# Altium project MyCTRL_V2_Base.PrjPcb
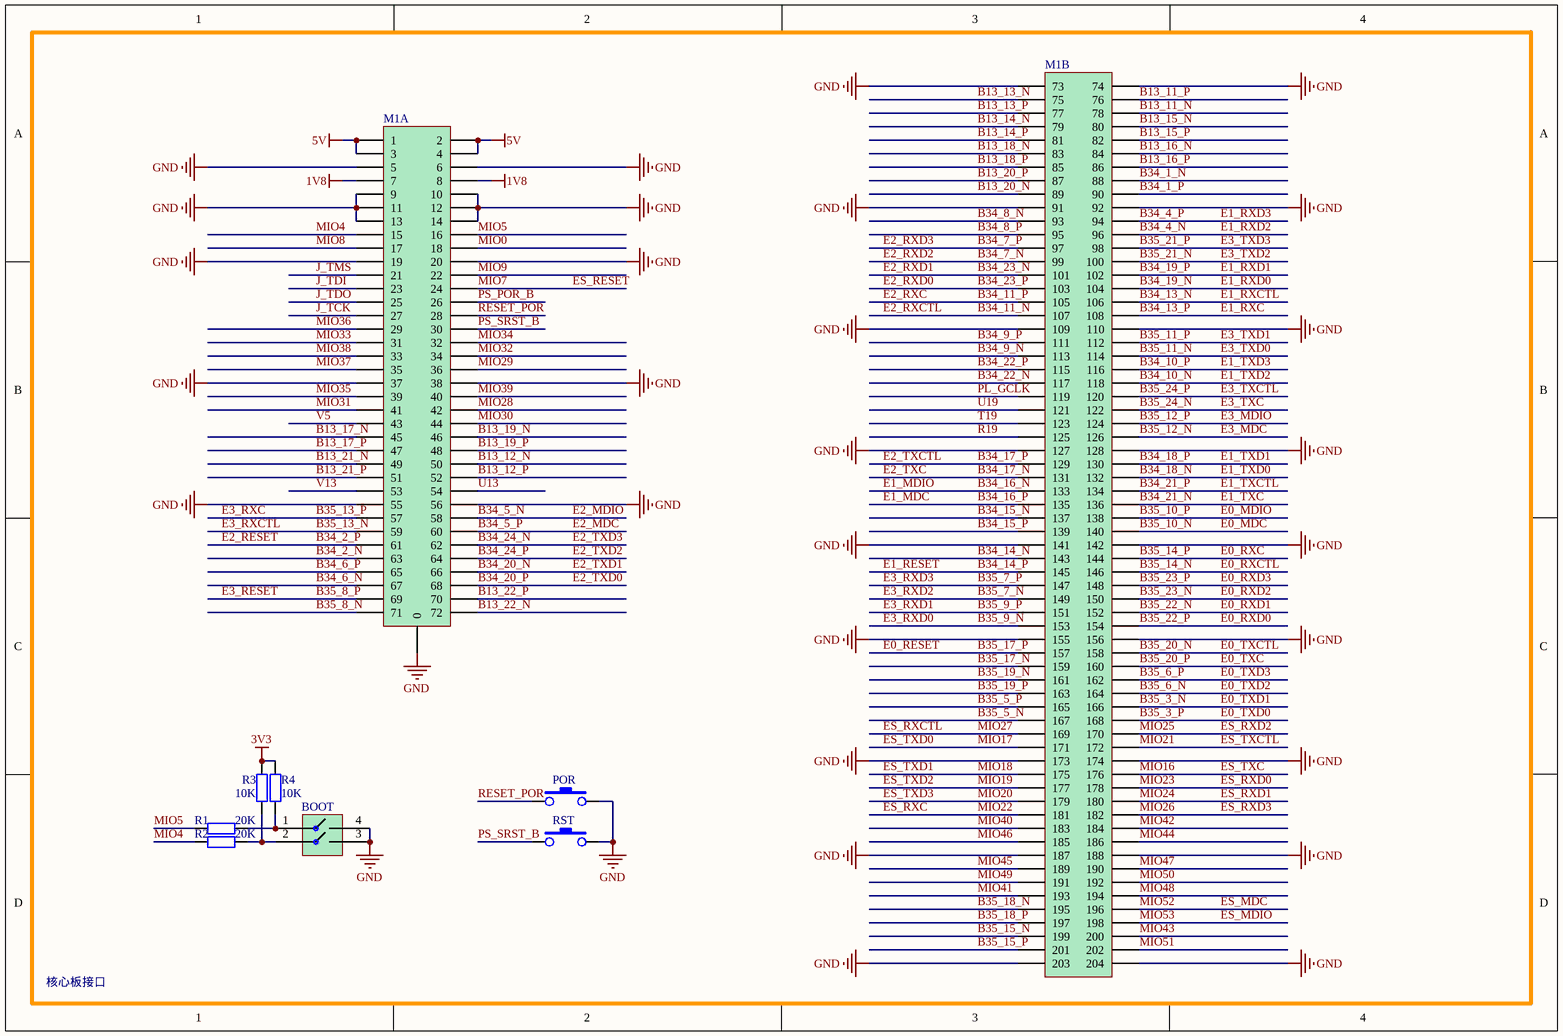
[diagram p0: MyCTRL_V2_Base_1.SchDoc]
6 sheets, 67 parts. Net scope: global (net labels, ports and power ports of the same name join across sheets).
Sheets:
  MyCTRL_V2_Base_1.SchDoc
  MyCTRL_V2_Base_2.SchDoc
  MyCTRL_V2_Base_3.SchDoc
  MyCTRL_V2_Base_4.SchDoc
  MyCTRL_V2_Base_5.SchDoc
  MyCTRL_V2_Base_6.SchDoc

## Sheet MyCTRL_V2_Base_1.SchDoc
size A4; SheetNumber: 1; SheetTotal: 6

### Parts
BOOT  DIP_SWITCH_2.54_2_SMD_S  [DIP_SWITCH_2.54_2_SMD_S]  (value not drawn)
M1  DDR3_204P_H8  [DDR3_204P_H8]  (value not drawn)  (parts A,B of 2)
POR  KEY  [KEY_DIP_6_L]  (value not drawn)
R1  20K  [R_0402]
R2  20K  [R_0402]
R3  10K  [R_0402]
R4  10K  [R_0402]
RST  KEY  [KEY_DIP_6_L]  (value not drawn)

### Nets
1V8: M1.7 M1.8
3V3: R3.2 R4.2
5V: M1.1 M1.2 M1.3 M1.4
GND: BOOT.3 BOOT.4 M1.0 M1.5 M1.6 M1.9 M1.10 M1.11 M1.12 M1.13 M1.14 M1.19 M1.20 M1.37 M1.38 M1.55 M1.56 M1.73 M1.74 M1.91 M1.92 M1.109 M1.110 M1.127 M1.128 M1.141 M1.142 M1.155 M1.156 M1.173 M1.174 M1.187 M1.188 M1.203 M1.204 POR.1 RST.1
B13_11_N: M1.78
B13_11_P: M1.76
B13_12_N: M1.50
B13_12_P: M1.52
B13_13_N: M1.75
B13_13_P: M1.77
B13_14_N: M1.79
B13_14_P: M1.81
B13_15_N: M1.80
B13_15_P: M1.82
B13_16_N: M1.84
B13_16_P: M1.86
B13_17_N: M1.45
B13_17_P: M1.47
B13_18_N: M1.83
B13_18_P: M1.85
B13_19_N: M1.46
B13_19_P: M1.48
B13_20_N: M1.89
B13_20_P: M1.87
B13_21_N: M1.49
B13_21_P: M1.51
B13_22_N: M1.72
B13_22_P: M1.70
B34_1_N: M1.88
B34_1_P: M1.90
B34_2_N: M1.63
B34_2_P: M1.61  [also labelled E2_RESET]
B34_4_N: M1.96  [also labelled E1_RXD2]
B34_4_P: M1.94  [also labelled E1_RXD3]
B34_5_N: M1.58  [also labelled E2_MDIO]
B34_5_P: M1.60  [also labelled E2_MDC]
B34_6_N: M1.67
B34_6_P: M1.65
B34_7_N: M1.99  [also labelled E2_RXD2]
B34_7_P: M1.97  [also labelled E2_RXD3]
B34_8_N: M1.93
B34_8_P: M1.95
B34_9_N: M1.113
B34_9_P: M1.111
B34_10_N: M1.118  [also labelled E1_TXD2]
B34_10_P: M1.116  [also labelled E1_TXD3]
B34_11_N: M1.107  [also labelled E2_RXCTL]
B34_11_P: M1.105  [also labelled E2_RXC]
B34_13_N: M1.106  [also labelled E1_RXCTL]
B34_13_P: M1.108  [also labelled E1_RXC]
B34_14_N: M1.143
B34_14_P: M1.145  [also labelled E1_RESET]
B34_15_N: M1.137
B34_15_P: M1.139
B34_16_N: M1.133  [also labelled E1_MDIO]
B34_16_P: M1.135  [also labelled E1_MDC]
B34_17_N: M1.131  [also labelled E2_TXC]
B34_17_P: M1.129  [also labelled E2_TXCTL]
B34_18_N: M1.132  [also labelled E1_TXD0]
B34_18_P: M1.130  [also labelled E1_TXD1]
B34_19_N: M1.104  [also labelled E1_RXD0]
B34_19_P: M1.102  [also labelled E1_RXD1]
B34_20_N: M1.66  [also labelled E2_TXD1]
B34_20_P: M1.68  [also labelled E2_TXD0]
B34_21_N: M1.136  [also labelled E1_TXC]
B34_21_P: M1.134  [also labelled E1_TXCTL]
B34_22_N: M1.117
B34_22_P: M1.115
B34_23_N: M1.101  [also labelled E2_RXD1]
B34_23_P: M1.103  [also labelled E2_RXD0]
B34_24_N: M1.62  [also labelled E2_TXD3]
B34_24_P: M1.64  [also labelled E2_TXD2]
B35_3_N: M1.166  [also labelled E0_TXD1]
B35_3_P: M1.168  [also labelled E0_TXD0]
B35_5_N: M1.167
B35_5_P: M1.165
B35_6_N: M1.164  [also labelled E0_TXD2]
B35_6_P: M1.162  [also labelled E0_TXD3]
B35_7_N: M1.149  [also labelled E3_RXD2]
B35_7_P: M1.147  [also labelled E3_RXD3]
B35_8_N: M1.71
B35_8_P: M1.69  [also labelled E3_RESET]
B35_9_N: M1.153  [also labelled E3_RXD0]
B35_9_P: M1.151  [also labelled E3_RXD1]
B35_10_N: M1.140  [also labelled E0_MDC]
B35_10_P: M1.138  [also labelled E0_MDIO]
B35_11_N: M1.114  [also labelled E3_TXD0]
B35_11_P: M1.112  [also labelled E3_TXD1]
B35_12_N: M1.126  [also labelled E3_MDC]
B35_12_P: M1.124  [also labelled E3_MDIO]
B35_13_N: M1.59  [also labelled E3_RXCTL]
B35_13_P: M1.57  [also labelled E3_RXC]
B35_14_N: M1.146  [also labelled E0_RXCTL]
B35_14_P: M1.144  [also labelled E0_RXC]
B35_15_N: M1.199
B35_15_P: M1.201
B35_17_N: M1.159
B35_17_P: M1.157  [also labelled E0_RESET]
B35_18_N: M1.195
B35_18_P: M1.197
B35_19_N: M1.161
B35_19_P: M1.163
B35_20_N: M1.158  [also labelled E0_TXCTL]
B35_20_P: M1.160  [also labelled E0_TXC]
B35_21_N: M1.100  [also labelled E3_TXD2]
B35_21_P: M1.98  [also labelled E3_TXD3]
B35_22_N: M1.152  [also labelled E0_RXD1]
B35_22_P: M1.154  [also labelled E0_RXD0]
B35_23_N: M1.150  [also labelled E0_RXD2]
B35_23_P: M1.148  [also labelled E0_RXD3]
B35_24_N: M1.122  [also labelled E3_TXC]
B35_24_P: M1.120  [also labelled E3_TXCTL]
ES_MDC: M1.196  [also labelled MIO52]
ES_MDIO: M1.198  [also labelled MIO53]
ES_RESET: M1.24  [also labelled MIO7]
ES_RXC: M1.181  [also labelled MIO22]
ES_RXCTL: M1.169  [also labelled MIO27]
ES_RXD0: M1.178  [also labelled MIO23]
ES_RXD1: M1.180  [also labelled MIO24]
ES_RXD2: M1.170  [also labelled MIO25]
ES_RXD3: M1.182  [also labelled MIO26]
ES_TXC: M1.176  [also labelled MIO16]
ES_TXCTL: M1.172  [also labelled MIO21]
ES_TXD0: M1.171  [also labelled MIO17]
ES_TXD1: M1.175  [also labelled MIO18]
ES_TXD2: M1.177  [also labelled MIO19]
ES_TXD3: M1.179  [also labelled MIO20]
J_TCK: M1.27
J_TDI: M1.23
J_TDO: M1.25
J_TMS: M1.21
MIO0: M1.18
MIO4: M1.15 R2.2
MIO5: M1.16 R1.2
MIO8: M1.17
MIO9: M1.22
MIO28: M1.42
MIO29: M1.36
MIO30: M1.44
MIO31: M1.41
MIO32: M1.34
MIO33: M1.31
MIO34: M1.32
MIO35: M1.39
MIO36: M1.29
MIO37: M1.35
MIO38: M1.33
MIO39: M1.40
MIO40: M1.183
MIO41: M1.193
MIO42: M1.184
MIO43: M1.200
MIO44: M1.186
MIO45: M1.189
MIO46: M1.185
MIO47: M1.190
MIO48: M1.194
MIO49: M1.191
MIO50: M1.192
MIO51: M1.202
PL_GCLK: M1.119
PS_POR_B: M1.26
PS_SRST_B: M1.30 RST.2
R19: M1.125
RESET_POR: M1.28 POR.2
T19: M1.123
U13: M1.54
U19: M1.121
V5: M1.43
V13: M1.53
NetBOOT_1: BOOT.1 R1.1 R4.1
NetBOOT_2: BOOT.2 R2.1 R3.1

### Notes on the sheet
- 核心板接口

### Library data of the parts
BOOT = DIP_SWITCH_2.54_2_SMD_S: 双路贴片立式拨码开关
POR RST = KEY_DIP_6_L: 直插卧式按键 6mm
R1-R4 = RES_0402: 电阻 0402

## Sheet MyCTRL_V2_Base_2.SchDoc
size A4; SheetNumber: 2; SheetTotal: 6
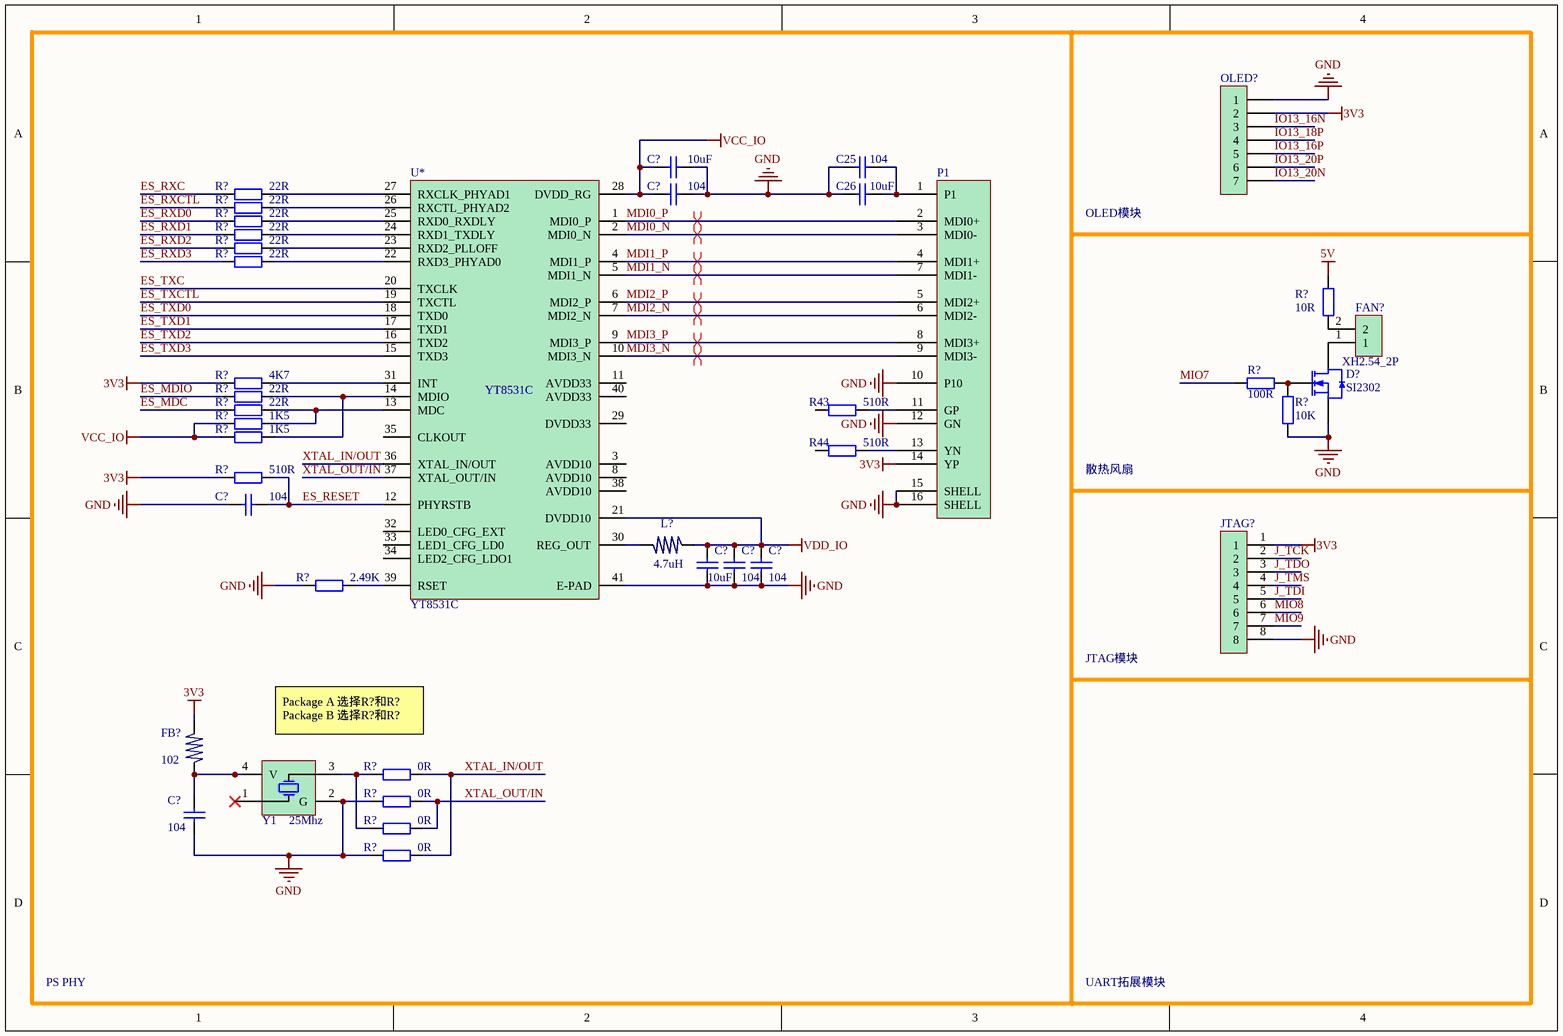
[diagram p1: MyCTRL_V2_Base_2.SchDoc]

### Parts
(Parts that share a designator on the sheet are numbered #1, #2 ... from top to bottom, then left to right.)
C25  104  [0402]
C26  10uF  [0402]
C?#1  10uF  [0402]
C?#2  104  [0402]
C?#3  104  [0402]
C?#4  10uF  [0402]
C?#5  104  [0402]
C?#6  104  [0402]
C?#7  104  [0402]
D?#1  SI2302  [SOT23]
FAN?  XH2.54_2P  [XH2.5_2P]
FB?  102  [0603]
JTAG?  SH1.25mm_8P  [SH1.25MM_8P]  (value not drawn)
L?  4.7uH  [0805]
OLED?  Header_2.54_7P  [HDR1_7P]  (value not drawn)
P1  RJ45  [HR911130A]  (value not drawn)
R43  510R  [R_0402]
R44  510R  [R_0402]
R?#1  22R  [R_0402]
R?#2  22R  [R_0402]
R?#3  22R  [R_0402]
R?#4  22R  [R_0402]
R?#5  22R  [R_0402]
R?#6  22R  [R_0402]
R?#7  10R  [R_0402]
R?#8  4K7  [R_0402]
R?#9  100R  [R_0402]
R?#10  10K  [R_0402]
R?#11  22R  [R_0402]
R?#12  22R  [R_0402]
R?#13  1K5  [R_0402]
R?#14  1K5  [R_0402]
R?#15  510R  [R_0402]
R?#16  2.49K  [R_0402]
R?#17  0R  [R_0402]
R?#18  0R  [R_0402]
R?#19  0R  [R_0402]
R?#20  0R  [R_0402]
U*  YT8531C
Y1  25Mhz  [XTAL_3225]

### Nets
3V3: FB?.1 JTAG?.1 OLED?.2 P1.14(YP) R?#8.1 R?#15.1
5V: R?#7.1
GND: C25.1 C26.1 C?#1.1 C?#2.2 C?#3.2 C?#4.1 C?#5.1 C?#6.1 C?#7.1 D?#1.2(S) JTAG?.8 OLED?.1 P1.10(P10) P1.12(GN) P1.15(SHELL) P1.16(SHELL) R?#10.2 R?#16.1 R?#18.1 R?#20.1 U*.41(E-PAD) Y1.2(G)
VCC_IO: C?#1.2 C?#2.1 R?#13.1 R?#14.1 U*.28(DVDD_RG)
VDD_IO: C?#4.2 C?#5.2 C?#6.2 L?.1 U*.21(DVDD10)
ES_MDC: R?#12.1
ES_MDIO: R?#11.1
ES_RESET: C?#3.1 R?#9.1 R?#15.2 U*.12(PHYRSTB)  [also labelled MIO7]
ES_RXC: R?#1.1
ES_RXCTL: R?#2.1
ES_RXD0: R?#3.1
ES_RXD1: R?#4.1
ES_RXD2: R?#5.1
ES_RXD3: R?#6.1
ES_TXC: U*.20(TXCLK)
ES_TXCTL: U*.19(TXCTL)
ES_TXD0: U*.18(TXD0)
ES_TXD1: U*.17(TXD1)
ES_TXD2: U*.16(TXD2)
ES_TXD3: U*.15(TXD3)
IO13_16N: OLED?.3
IO13_16P: OLED?.5
IO13_18P: OLED?.4
IO13_20N: OLED?.7
IO13_20P: OLED?.6
J_TCK: JTAG?.2
J_TDI: JTAG?.5
J_TDO: JTAG?.3
J_TMS: JTAG?.4
MDI0_N: P1.3(MDI0-) U*.2(MDI0_N)
MDI0_P: P1.2(MDI0+) U*.1(MDI0_P)
MDI1_N: P1.7(MDI1-) U*.5(MDI1_N)
MDI1_P: P1.4(MDI1+) U*.4(MDI1_P)
MDI2_N: P1.6(MDI2-) U*.7(MDI2_N)
MDI2_P: P1.5(MDI2+) U*.6(MDI2_P)
MDI3_N: P1.9(MDI3-) U*.10(MDI3_N)
MDI3_P: P1.8(MDI3+) U*.9(MDI3_P)
MIO8: JTAG?.6
MIO9: JTAG?.7
XTAL_IN/OUT: R?#17.2 R?#20.2 U*.36(XTAL_IN/OUT)
XTAL_OUT/IN: R?#18.2 R?#19.2 U*.37(XTAL_OUT/IN)
NetC25_2: C25.2 C26.2 P1.1(P1)
NetC?#7_2: C?#7.2 FB?.2 Y1.4(V)
NetD?#1_1: D?#1.1(G) R?#9.2 R?#10.1
NetD?#1_3: D?#1.3(D) FAN?.1
NetFAN?_2: FAN?.2 R?#7.2
NetL?_2: L?.2 U*.30(REG_OUT)
NetP1_11: P1.11(GP) R43.2
NetP1_13: P1.13(YN) R44.2
NetR?#1_2: R?#1.2 U*.27(RXCLK_PHYAD1)
NetR?#2_2: R?#2.2 U*.26(RXCTL_PHYAD2)
NetR?#3_2: R?#3.2 U*.25(RXD0_RXDLY)
NetR?#4_2: R?#4.2 U*.24(RXD1_TXDLY)
NetR?#5_2: R?#5.2 U*.23(RXD2_PLLOFF)
NetR?#6_2: R?#6.2 U*.22(RXD3_PHYAD0)
NetR?#8_2: R?#8.2 U*.31(INT)
NetR?#11_2: R?#11.2 R?#14.2 U*.14(MDIO)
NetR?#12_2: R?#12.2 R?#13.2 U*.13(MDC)
NetR?#16_2: R?#16.2 U*.39(RSET)
NetR?#17_1: R?#17.1 R?#19.1 Y1.3(OP)

Not connected (* = marked no-connect by the designer): R43 1; R44 1; U* 3(AVDD10) 8(AVDD10) 11(AVDD33) 29(DVDD33) 32(LED0_CFG_EXT) 33(LED1_CFG_LD0) 34(LED2_CFG_LDO1) 35(CLKOUT) 38(AVDD10) 40(AVDD33); Y1 1(EC)*

### Layout directives
differential pair: MDI0_N, MDI0_P, MDI1_N, MDI1_P, MDI2_N, MDI2_P, MDI3_N, MDI3_P

### Notes on the sheet
- OLED模块
- 散热风扇
- JTAG模块
- Package A 选择R?和R?
  Package B 选择R?和R?
- PS PHY
- UART拓展模块

### Library data of the parts
C25 C26 C?#1-C?#7 = CAP_0402: 贴片电容 0402
D?#1 = MOSN_SI2302_SOT23: NMOS
FB? = FB_0603: 磁珠 0603
L? = L_0805: 电感 0805
P1 = RJ45_HR911130A
R43 R44 R?#1-R?#20 = RES_0402: 电阻 0402
U* = YT8531C: ETH1 10/100/1000M
Y1 = XTAL_3225: 贴片有源晶振

## Sheet MyCTRL_V2_Base_3.SchDoc
size A4; SheetNumber: 3; SheetTotal: 6
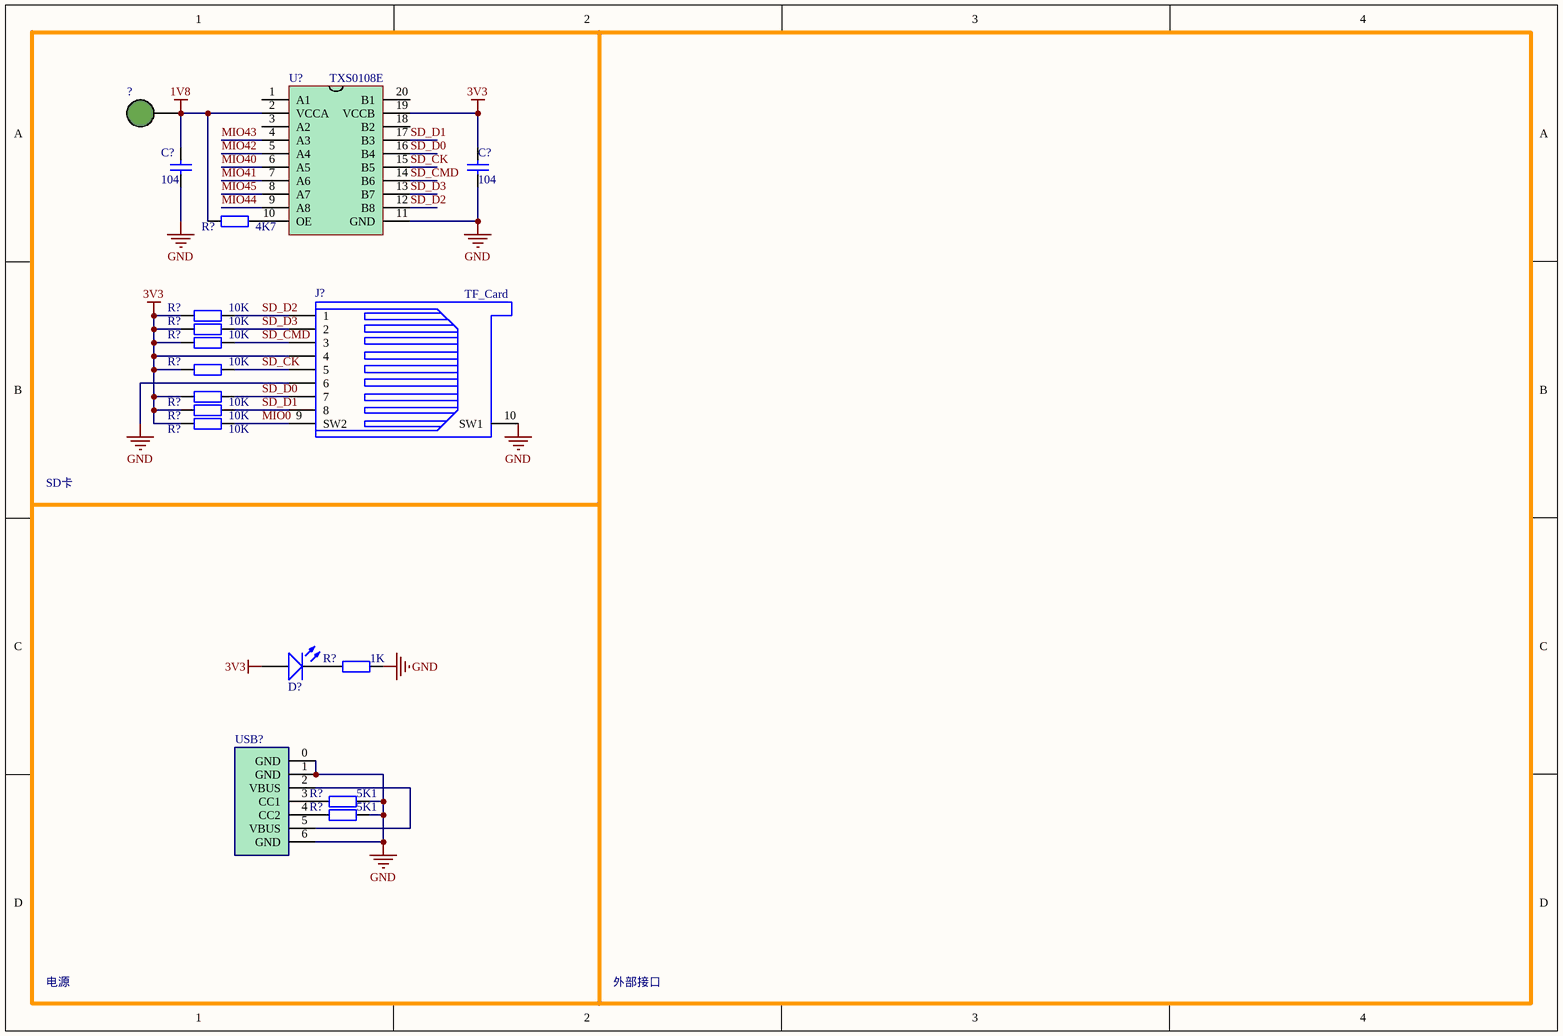
[diagram p2: MyCTRL_V2_Base_3.SchDoc]

### Parts
(Parts that share a designator on the sheet are numbered #1, #2 ... from top to bottom, then left to right.)
?  TEST_POINT_2mm  [TEST_POINT_2mm]  (value not drawn)
C?#8  104  [0402]
C?#9  104  [0402]
D?#2  LED  [LED_0603]  (value not drawn)
J?  TF_Card  [TF_card]
R?#21  4K7  [R_0402]
R?#22  10K  [R_0402]
R?#23  10K  [R_0402]
R?#24  10K  [R_0402]
R?#25  10K  [R_0402]
R?#26  10K  [R_0402]
R?#27  10K  [R_0402]
R?#28  10K  [R_0402]
R?#29  1K  [R_0402]
R?#30  5K1  [R_0402]
R?#31  5K1  [R_0402]
U?  TXS0108E  [TSSOP20]
USB?  USB_C_6P  [USB_C_6PIN]  (value not drawn)

### Nets
1V8: ?.1 C?#8.2 R?#21.1 U?.2(VCCA)
3V3: C?#9.2 D?#2.A J?.4 R?#22.1 R?#23.1 R?#24.1 R?#25.1 R?#26.1 R?#27.1 R?#28.1 U?.19(VCCB)
GND: C?#8.1 C?#9.1 J?.6 J?.10(SW1) R?#29.2 R?#30.1 R?#31.1 U?.11(GND) USB?.0(GND) USB?.1(GND) USB?.6(GND)
MIO0: J?.9(SW2) R?#28.2
MIO40: U?.6(A5)
MIO41: U?.7(A6)
MIO42: U?.5(A4)
MIO43: U?.4(A3)
MIO44: U?.9(A8)
MIO45: U?.8(A7)
SD_CK: J?.5 R?#25.2 U?.15(B5)
SD_CMD: J?.3 R?#24.2 U?.14(B6)
SD_D0: J?.7 R?#26.2 U?.16(B4)
SD_D1: J?.8 R?#27.2 U?.17(B3)
SD_D2: J?.1 R?#22.2 U?.12(B8)
SD_D3: J?.2 R?#23.2 U?.13(B7)
NetD?#2_K: D?#2.K R?#29.1
NetR?#21_2: R?#21.2 U?.10(OE)
NetR?#30_2: R?#30.2 USB?.3(CC1)
NetR?#31_2: R?#31.2 USB?.4(CC2)
NetUSB?_2: USB?.2(VBUS) USB?.5(VBUS)

Not connected (* = marked no-connect by the designer): U? 1(A1) 3(A2) 18(B2) 20(B1)

### Notes on the sheet
- SD卡
- 电源
- 外部接口

### Library data of the parts
C?#8 C?#9 = CAP_0402: 贴片电容 0402
D?#2 = LED_0603: LED 0603
J? = TF_Card: TF卡座
R?#21-R?#31 = RES_0402: 电阻 0402

## Sheet MyCTRL_V2_Base_4.SchDoc
size A4; SheetNumber: 4; SheetTotal: 6
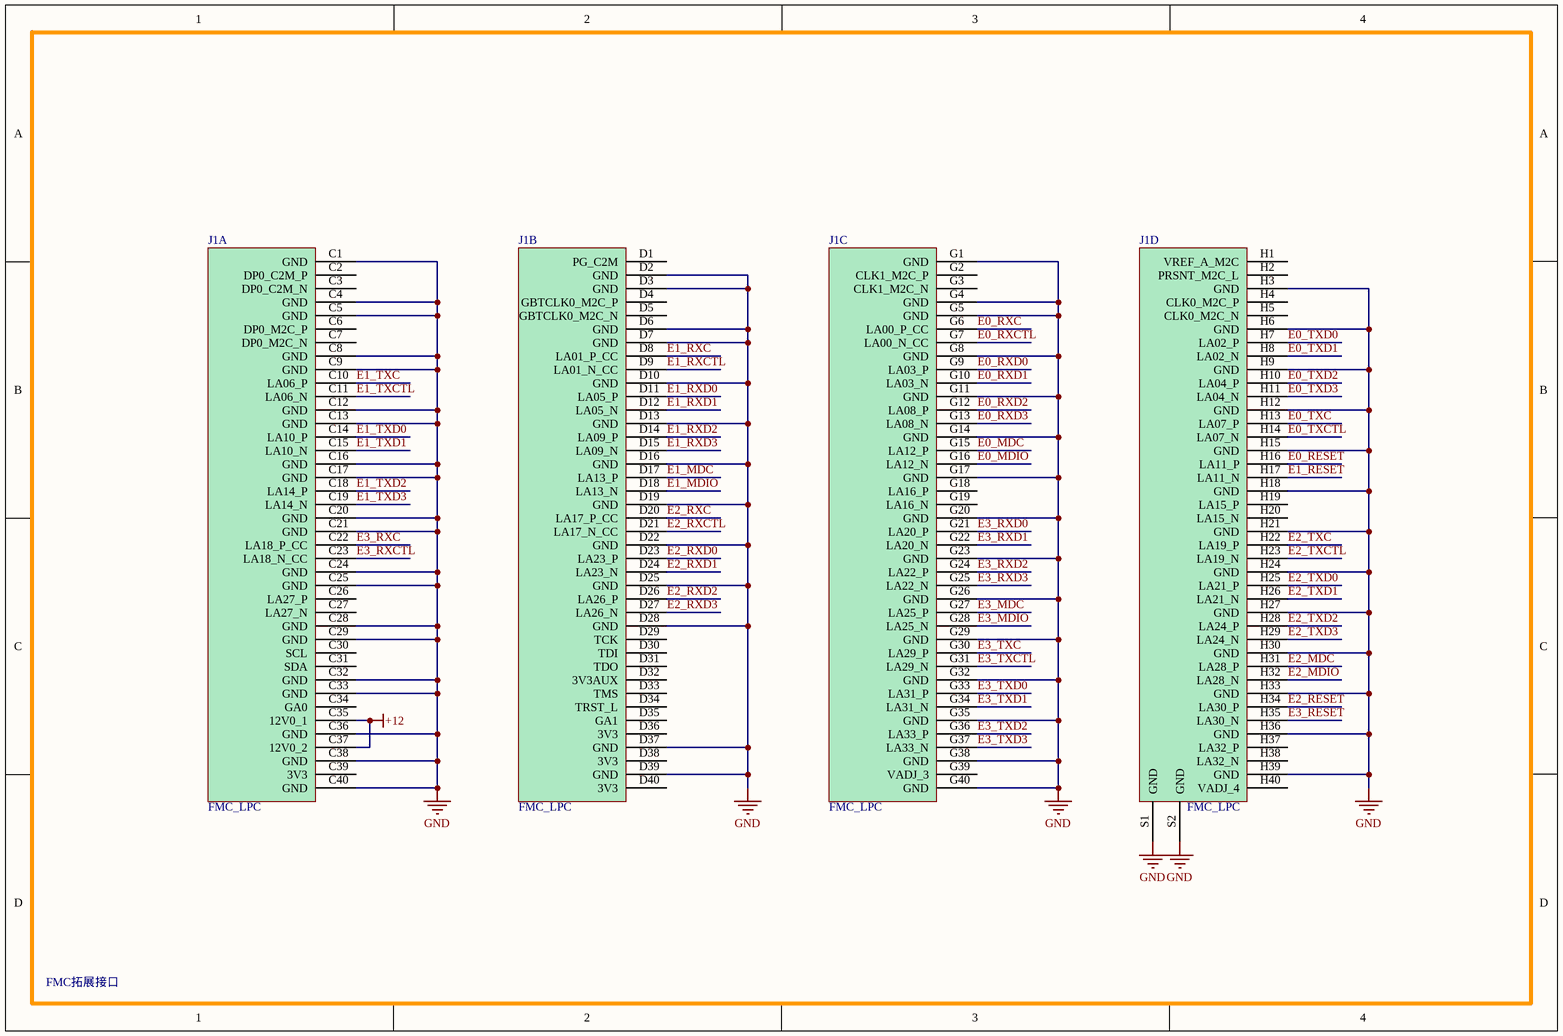
[diagram p3: MyCTRL_V2_Base_4.SchDoc]

### Parts
J1  FMC_LPC  (parts A,B,C,D of 4)

### Nets
+12: J1.C35(12V0_1) J1.C37(12V0_2)
GND: J1.C1(GND) J1.C4(GND) J1.C5(GND) J1.C8(GND) J1.C9(GND) J1.C12(GND) J1.C13(GND) J1.C16(GND) J1.C17(GND) J1.C20(GND) J1.C21(GND) J1.C24(GND) J1.C25(GND) J1.C28(GND) J1.C29(GND) J1.C32(GND) J1.C33(GND) J1.C36(GND) J1.C38(GND) J1.C40(GND) J1.D2(GND) J1.D3(GND) J1.D6(GND) J1.D7(GND) J1.D10(GND) J1.D13(GND) J1.D16(GND) J1.D19(GND) J1.D22(GND) J1.D25(GND) J1.D28(GND) J1.D37(GND) J1.D39(GND) J1.G1(GND) J1.G4(GND) J1.G5(GND) J1.G8(GND) J1.G11(GND) J1.G14(GND) J1.G17(GND) J1.G20(GND) J1.G23(GND) J1.G26(GND) J1.G29(GND) J1.G32(GND) J1.G35(GND) J1.G38(GND) J1.G40(GND) J1.H3(GND) J1.H6(GND) J1.H9(GND) J1.H12(GND) J1.H15(GND) J1.H18(GND) J1.H21(GND) J1.H24(GND) J1.H27(GND) J1.H30(GND) J1.H33(GND) J1.H36(GND) J1.H39(GND) J1.S1(GND) J1.S2(GND)
E0_MDC: J1.G15(LA12_P)  [project net B35_10_N]
E0_MDIO: J1.G16(LA12_N)  [project net B35_10_P]
E0_RESET: J1.H16(LA11_P)  [project net B35_17_P]
E0_RXC: J1.G6(LA00_P_CC)  [project net B35_14_P]
E0_RXCTL: J1.G7(LA00_N_CC)  [project net B35_14_N]
E0_RXD0: J1.G9(LA03_P)  [project net B35_22_P]
E0_RXD1: J1.G10(LA03_N)  [project net B35_22_N]
E0_RXD2: J1.G12(LA08_P)  [project net B35_23_N]
E0_RXD3: J1.G13(LA08_N)  [project net B35_23_P]
E0_TXC: J1.H13(LA07_P)  [project net B35_20_P]
E0_TXCTL: J1.H14(LA07_N)  [project net B35_20_N]
E0_TXD0: J1.H7(LA02_P)  [project net B35_3_P]
E0_TXD1: J1.H8(LA02_N)  [project net B35_3_N]
E0_TXD2: J1.H10(LA04_P)  [project net B35_6_N]
E0_TXD3: J1.H11(LA04_N)  [project net B35_6_P]
E1_MDC: J1.D17(LA13_P)  [project net B34_16_P]
E1_MDIO: J1.D18(LA13_N)  [project net B34_16_N]
E1_RESET: J1.H17(LA11_N)  [project net B34_14_P]
E1_RXC: J1.D8(LA01_P_CC)  [project net B34_13_P]
E1_RXCTL: J1.D9(LA01_N_CC)  [project net B34_13_N]
E1_RXD0: J1.D11(LA05_P)  [project net B34_19_N]
E1_RXD1: J1.D12(LA05_N)  [project net B34_19_P]
E1_RXD2: J1.D14(LA09_P)  [project net B34_4_N]
E1_RXD3: J1.D15(LA09_N)  [project net B34_4_P]
E1_TXC: J1.C10(LA06_P)  [project net B34_21_N]
E1_TXCTL: J1.C11(LA06_N)  [project net B34_21_P]
E1_TXD0: J1.C14(LA10_P)  [project net B34_18_N]
E1_TXD1: J1.C15(LA10_N)  [project net B34_18_P]
E1_TXD2: J1.C18(LA14_P)  [project net B34_10_N]
E1_TXD3: J1.C19(LA14_N)  [project net B34_10_P]
E2_MDC: J1.H31(LA28_P)  [project net B34_5_P]
E2_MDIO: J1.H32(LA28_N)  [project net B34_5_N]
E2_RESET: J1.H34(LA30_P)  [project net B34_2_P]
E2_RXC: J1.D20(LA17_P_CC)  [project net B34_11_P]
E2_RXCTL: J1.D21(LA17_N_CC)  [project net B34_11_N]
E2_RXD0: J1.D23(LA23_P)  [project net B34_23_P]
E2_RXD1: J1.D24(LA23_N)  [project net B34_23_N]
E2_RXD2: J1.D26(LA26_P)  [project net B34_7_N]
E2_RXD3: J1.D27(LA26_N)  [project net B34_7_P]
E2_TXC: J1.H22(LA19_P)  [project net B34_17_N]
E2_TXCTL: J1.H23(LA19_N)  [project net B34_17_P]
E2_TXD0: J1.H25(LA21_P)  [project net B34_20_P]
E2_TXD1: J1.H26(LA21_N)  [project net B34_20_N]
E2_TXD2: J1.H28(LA24_P)  [project net B34_24_P]
E2_TXD3: J1.H29(LA24_N)  [project net B34_24_N]
E3_MDC: J1.G27(LA25_P)  [project net B35_12_N]
E3_MDIO: J1.G28(LA25_N)  [project net B35_12_P]
E3_RESET: J1.H35(LA30_N)  [project net B35_8_P]
E3_RXC: J1.C22(LA18_P_CC)  [project net B35_13_P]
E3_RXCTL: J1.C23(LA18_N_CC)  [project net B35_13_N]
E3_RXD0: J1.G21(LA20_P)  [project net B35_9_N]
E3_RXD1: J1.G22(LA20_N)  [project net B35_9_P]
E3_RXD2: J1.G24(LA22_P)  [project net B35_7_N]
E3_RXD3: J1.G25(LA22_N)  [project net B35_7_P]
E3_TXC: J1.G30(LA29_P)  [project net B35_24_N]
E3_TXCTL: J1.G31(LA29_N)  [project net B35_24_P]
E3_TXD0: J1.G33(LA31_P)  [project net B35_11_N]
E3_TXD1: J1.G34(LA31_N)  [project net B35_11_P]
E3_TXD2: J1.G36(LA33_P)  [project net B35_21_N]
E3_TXD3: J1.G37(LA33_N)  [project net B35_21_P]

Not connected (* = marked no-connect by the designer): J1 C2(DP0_C2M_P) C3(DP0_C2M_N) C6(DP0_M2C_P) C7(DP0_M2C_N) C26(LA27_P) C27(LA27_N) C30(SCL) C31(SDA) C34(GA0) C39(3V3) D1(PG_C2M) D4(GBTCLK0_M2C_P) D5(GBTCLK0_M2C_N) D29(TCK) D30(TDI) D31(TDO) D32(3V3AUX) D33(TMS) D34(TRST_L) D35(GA1) D36(3V3) D38(3V3) D40(3V3) G2(CLK1_M2C_P) G3(CLK1_M2C_N) G18(LA16_P) G19(LA16_N) G39(VADJ_3) H1(VREF_A_M2C) H2(PRSNT_M2C_L) H4(CLK0_M2C_P) H5(CLK0_M2C_N) H19(LA15_P) H20(LA15_N) H37(LA32_P) H38(LA32_N) H40(VADJ_4)

### Notes on the sheet
- FMC拓展接口

### Library data of the parts
J1 = FMC_LPC_F_SMT

## Sheet MyCTRL_V2_Base_5.SchDoc
size A4; SheetNumber: 5; SheetTotal: 6
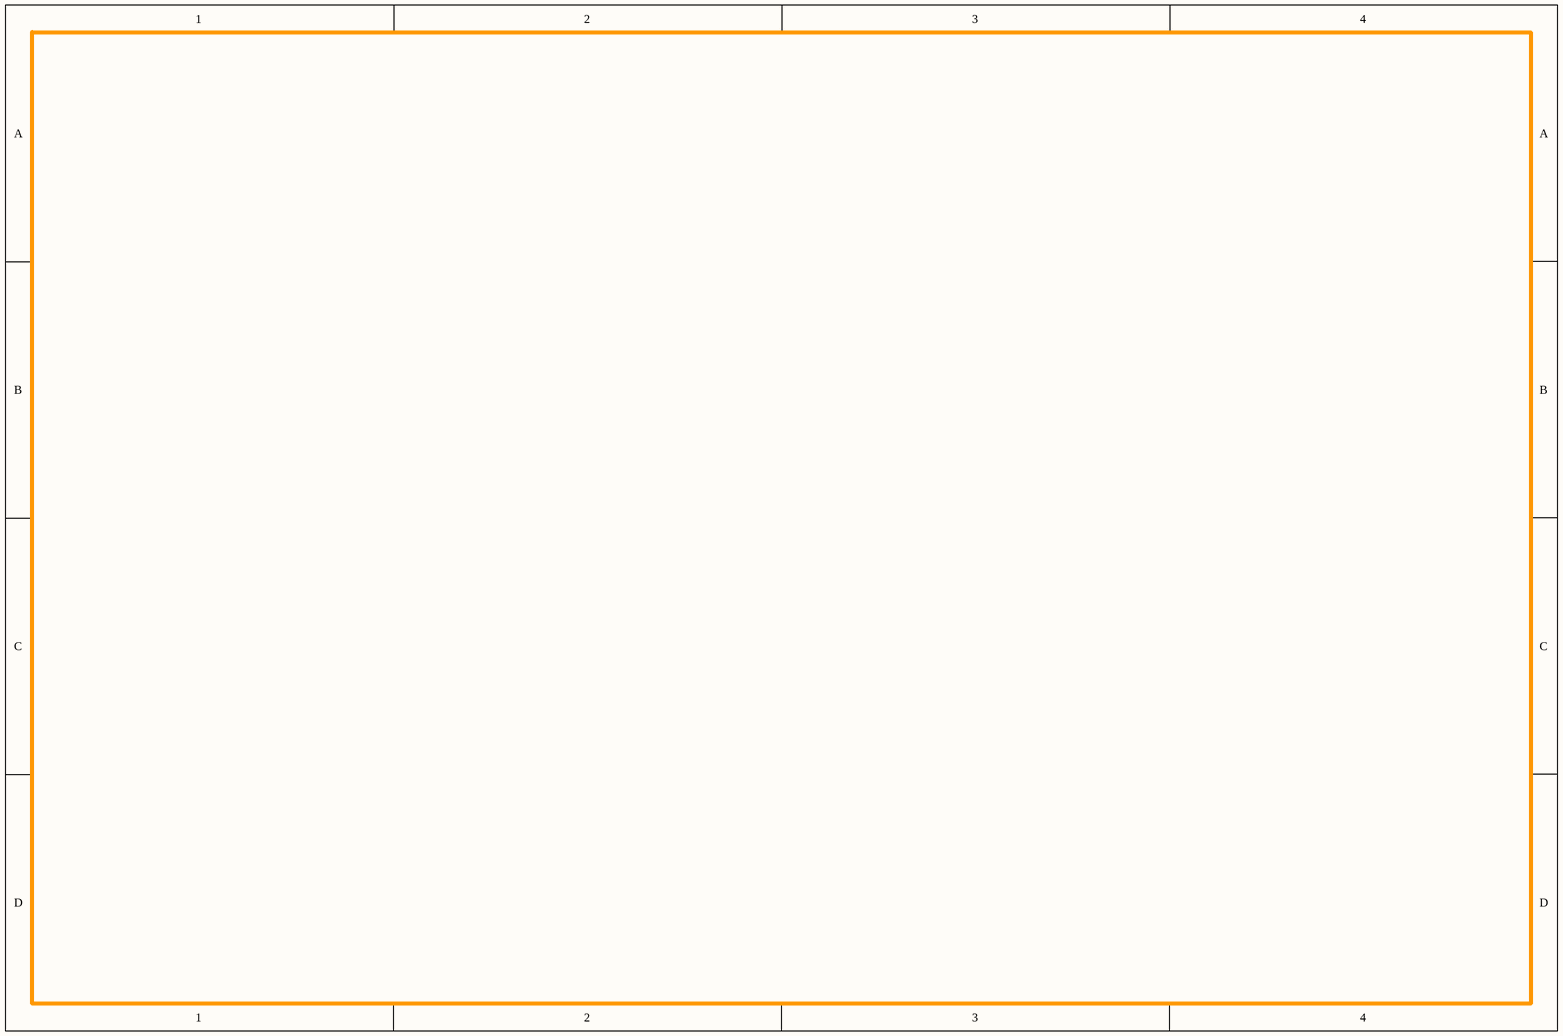
[diagram p4: MyCTRL_V2_Base_5.SchDoc]

## Sheet MyCTRL_V2_Base_6.SchDoc
size A4; SheetNumber: 6; SheetTotal: 6
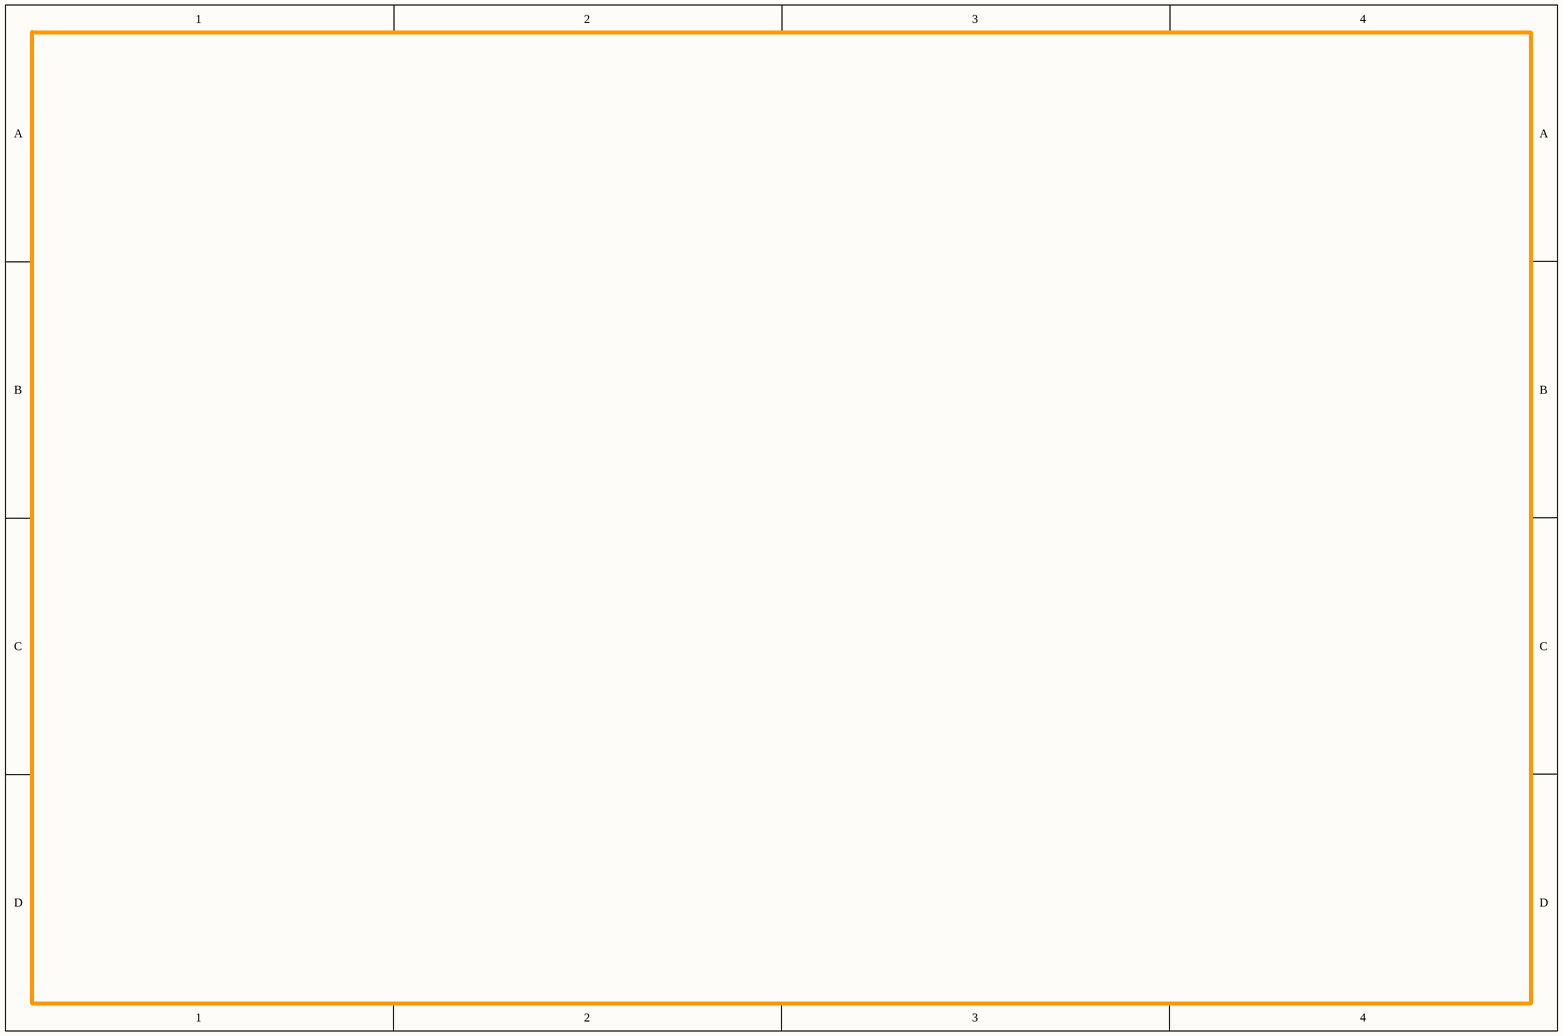
[diagram p5: MyCTRL_V2_Base_6.SchDoc]

## Nets that join several sheets
1V8: MyCTRL_V2_Base_1 (M1.7 M1.8), MyCTRL_V2_Base_3 (?.1 C?#8.2 R?#21.1 U?.2)
3V3: MyCTRL_V2_Base_1 (R3.2 R4.2), MyCTRL_V2_Base_2 (6 pins), MyCTRL_V2_Base_3 (11 pins)
5V: MyCTRL_V2_Base_1 (M1.1 M1.2 M1.3 M1.4), MyCTRL_V2_Base_2 (R?#7.1)
GND: MyCTRL_V2_Base_1 (37 pins), MyCTRL_V2_Base_2 (22 pins), MyCTRL_V2_Base_3 (11 pins), MyCTRL_V2_Base_4 (63 pins)
B34_2_P: MyCTRL_V2_Base_1 (M1.61), MyCTRL_V2_Base_4 (J1.H34)
B34_4_N: MyCTRL_V2_Base_1 (M1.96), MyCTRL_V2_Base_4 (J1.D14)
B34_4_P: MyCTRL_V2_Base_1 (M1.94), MyCTRL_V2_Base_4 (J1.D15)
B34_5_N: MyCTRL_V2_Base_1 (M1.58), MyCTRL_V2_Base_4 (J1.H32)
B34_5_P: MyCTRL_V2_Base_1 (M1.60), MyCTRL_V2_Base_4 (J1.H31)
B34_7_N: MyCTRL_V2_Base_1 (M1.99), MyCTRL_V2_Base_4 (J1.D26)
B34_7_P: MyCTRL_V2_Base_1 (M1.97), MyCTRL_V2_Base_4 (J1.D27)
B34_10_N: MyCTRL_V2_Base_1 (M1.118), MyCTRL_V2_Base_4 (J1.C18)
B34_10_P: MyCTRL_V2_Base_1 (M1.116), MyCTRL_V2_Base_4 (J1.C19)
B34_11_N: MyCTRL_V2_Base_1 (M1.107), MyCTRL_V2_Base_4 (J1.D21)
B34_11_P: MyCTRL_V2_Base_1 (M1.105), MyCTRL_V2_Base_4 (J1.D20)
B34_13_N: MyCTRL_V2_Base_1 (M1.106), MyCTRL_V2_Base_4 (J1.D9)
B34_13_P: MyCTRL_V2_Base_1 (M1.108), MyCTRL_V2_Base_4 (J1.D8)
B34_14_P: MyCTRL_V2_Base_1 (M1.145), MyCTRL_V2_Base_4 (J1.H17)
B34_16_N: MyCTRL_V2_Base_1 (M1.133), MyCTRL_V2_Base_4 (J1.D18)
B34_16_P: MyCTRL_V2_Base_1 (M1.135), MyCTRL_V2_Base_4 (J1.D17)
B34_17_N: MyCTRL_V2_Base_1 (M1.131), MyCTRL_V2_Base_4 (J1.H22)
B34_17_P: MyCTRL_V2_Base_1 (M1.129), MyCTRL_V2_Base_4 (J1.H23)
B34_18_N: MyCTRL_V2_Base_1 (M1.132), MyCTRL_V2_Base_4 (J1.C14)
B34_18_P: MyCTRL_V2_Base_1 (M1.130), MyCTRL_V2_Base_4 (J1.C15)
B34_19_N: MyCTRL_V2_Base_1 (M1.104), MyCTRL_V2_Base_4 (J1.D11)
B34_19_P: MyCTRL_V2_Base_1 (M1.102), MyCTRL_V2_Base_4 (J1.D12)
B34_20_N: MyCTRL_V2_Base_1 (M1.66), MyCTRL_V2_Base_4 (J1.H26)
B34_20_P: MyCTRL_V2_Base_1 (M1.68), MyCTRL_V2_Base_4 (J1.H25)
B34_21_N: MyCTRL_V2_Base_1 (M1.136), MyCTRL_V2_Base_4 (J1.C10)
B34_21_P: MyCTRL_V2_Base_1 (M1.134), MyCTRL_V2_Base_4 (J1.C11)
B34_23_N: MyCTRL_V2_Base_1 (M1.101), MyCTRL_V2_Base_4 (J1.D24)
B34_23_P: MyCTRL_V2_Base_1 (M1.103), MyCTRL_V2_Base_4 (J1.D23)
B34_24_N: MyCTRL_V2_Base_1 (M1.62), MyCTRL_V2_Base_4 (J1.H29)
B34_24_P: MyCTRL_V2_Base_1 (M1.64), MyCTRL_V2_Base_4 (J1.H28)
B35_3_N: MyCTRL_V2_Base_1 (M1.166), MyCTRL_V2_Base_4 (J1.H8)
B35_3_P: MyCTRL_V2_Base_1 (M1.168), MyCTRL_V2_Base_4 (J1.H7)
B35_6_N: MyCTRL_V2_Base_1 (M1.164), MyCTRL_V2_Base_4 (J1.H10)
B35_6_P: MyCTRL_V2_Base_1 (M1.162), MyCTRL_V2_Base_4 (J1.H11)
B35_7_N: MyCTRL_V2_Base_1 (M1.149), MyCTRL_V2_Base_4 (J1.G24)
B35_7_P: MyCTRL_V2_Base_1 (M1.147), MyCTRL_V2_Base_4 (J1.G25)
B35_8_P: MyCTRL_V2_Base_1 (M1.69), MyCTRL_V2_Base_4 (J1.H35)
B35_9_N: MyCTRL_V2_Base_1 (M1.153), MyCTRL_V2_Base_4 (J1.G21)
B35_9_P: MyCTRL_V2_Base_1 (M1.151), MyCTRL_V2_Base_4 (J1.G22)
B35_10_N: MyCTRL_V2_Base_1 (M1.140), MyCTRL_V2_Base_4 (J1.G15)
B35_10_P: MyCTRL_V2_Base_1 (M1.138), MyCTRL_V2_Base_4 (J1.G16)
B35_11_N: MyCTRL_V2_Base_1 (M1.114), MyCTRL_V2_Base_4 (J1.G33)
B35_11_P: MyCTRL_V2_Base_1 (M1.112), MyCTRL_V2_Base_4 (J1.G34)
B35_12_N: MyCTRL_V2_Base_1 (M1.126), MyCTRL_V2_Base_4 (J1.G27)
B35_12_P: MyCTRL_V2_Base_1 (M1.124), MyCTRL_V2_Base_4 (J1.G28)
B35_13_N: MyCTRL_V2_Base_1 (M1.59), MyCTRL_V2_Base_4 (J1.C23)
B35_13_P: MyCTRL_V2_Base_1 (M1.57), MyCTRL_V2_Base_4 (J1.C22)
B35_14_N: MyCTRL_V2_Base_1 (M1.146), MyCTRL_V2_Base_4 (J1.G7)
B35_14_P: MyCTRL_V2_Base_1 (M1.144), MyCTRL_V2_Base_4 (J1.G6)
B35_17_P: MyCTRL_V2_Base_1 (M1.157), MyCTRL_V2_Base_4 (J1.H16)
B35_20_N: MyCTRL_V2_Base_1 (M1.158), MyCTRL_V2_Base_4 (J1.H14)
B35_20_P: MyCTRL_V2_Base_1 (M1.160), MyCTRL_V2_Base_4 (J1.H13)
B35_21_N: MyCTRL_V2_Base_1 (M1.100), MyCTRL_V2_Base_4 (J1.G36)
B35_21_P: MyCTRL_V2_Base_1 (M1.98), MyCTRL_V2_Base_4 (J1.G37)
B35_22_N: MyCTRL_V2_Base_1 (M1.152), MyCTRL_V2_Base_4 (J1.G10)
B35_22_P: MyCTRL_V2_Base_1 (M1.154), MyCTRL_V2_Base_4 (J1.G9)
B35_23_N: MyCTRL_V2_Base_1 (M1.150), MyCTRL_V2_Base_4 (J1.G12)
B35_23_P: MyCTRL_V2_Base_1 (M1.148), MyCTRL_V2_Base_4 (J1.G13)
B35_24_N: MyCTRL_V2_Base_1 (M1.122), MyCTRL_V2_Base_4 (J1.G30)
B35_24_P: MyCTRL_V2_Base_1 (M1.120), MyCTRL_V2_Base_4 (J1.G31)
ES_MDC: MyCTRL_V2_Base_1 (M1.196), MyCTRL_V2_Base_2 (R?#12.1)
ES_MDIO: MyCTRL_V2_Base_1 (M1.198), MyCTRL_V2_Base_2 (R?#11.1)
ES_RESET: MyCTRL_V2_Base_1 (M1.24), MyCTRL_V2_Base_2 (C?#3.1 R?#9.1 R?#15.2 U*.12)
ES_RXC: MyCTRL_V2_Base_1 (M1.181), MyCTRL_V2_Base_2 (R?#1.1)
ES_RXCTL: MyCTRL_V2_Base_1 (M1.169), MyCTRL_V2_Base_2 (R?#2.1)
ES_RXD0: MyCTRL_V2_Base_1 (M1.178), MyCTRL_V2_Base_2 (R?#3.1)
ES_RXD1: MyCTRL_V2_Base_1 (M1.180), MyCTRL_V2_Base_2 (R?#4.1)
ES_RXD2: MyCTRL_V2_Base_1 (M1.170), MyCTRL_V2_Base_2 (R?#5.1)
ES_RXD3: MyCTRL_V2_Base_1 (M1.182), MyCTRL_V2_Base_2 (R?#6.1)
ES_TXC: MyCTRL_V2_Base_1 (M1.176), MyCTRL_V2_Base_2 (U*.20)
ES_TXCTL: MyCTRL_V2_Base_1 (M1.172), MyCTRL_V2_Base_2 (U*.19)
ES_TXD0: MyCTRL_V2_Base_1 (M1.171), MyCTRL_V2_Base_2 (U*.18)
ES_TXD1: MyCTRL_V2_Base_1 (M1.175), MyCTRL_V2_Base_2 (U*.17)
ES_TXD2: MyCTRL_V2_Base_1 (M1.177), MyCTRL_V2_Base_2 (U*.16)
ES_TXD3: MyCTRL_V2_Base_1 (M1.179), MyCTRL_V2_Base_2 (U*.15)
J_TCK: MyCTRL_V2_Base_1 (M1.27), MyCTRL_V2_Base_2 (JTAG?.2)
J_TDI: MyCTRL_V2_Base_1 (M1.23), MyCTRL_V2_Base_2 (JTAG?.5)
J_TDO: MyCTRL_V2_Base_1 (M1.25), MyCTRL_V2_Base_2 (JTAG?.3)
J_TMS: MyCTRL_V2_Base_1 (M1.21), MyCTRL_V2_Base_2 (JTAG?.4)
MIO0: MyCTRL_V2_Base_1 (M1.18), MyCTRL_V2_Base_3 (J?.9 R?#28.2)
MIO8: MyCTRL_V2_Base_1 (M1.17), MyCTRL_V2_Base_2 (JTAG?.6)
MIO9: MyCTRL_V2_Base_1 (M1.22), MyCTRL_V2_Base_2 (JTAG?.7)
MIO40: MyCTRL_V2_Base_1 (M1.183), MyCTRL_V2_Base_3 (U?.6)
MIO41: MyCTRL_V2_Base_1 (M1.193), MyCTRL_V2_Base_3 (U?.7)
MIO42: MyCTRL_V2_Base_1 (M1.184), MyCTRL_V2_Base_3 (U?.5)
MIO43: MyCTRL_V2_Base_1 (M1.200), MyCTRL_V2_Base_3 (U?.4)
MIO44: MyCTRL_V2_Base_1 (M1.186), MyCTRL_V2_Base_3 (U?.9)
MIO45: MyCTRL_V2_Base_1 (M1.189), MyCTRL_V2_Base_3 (U?.8)